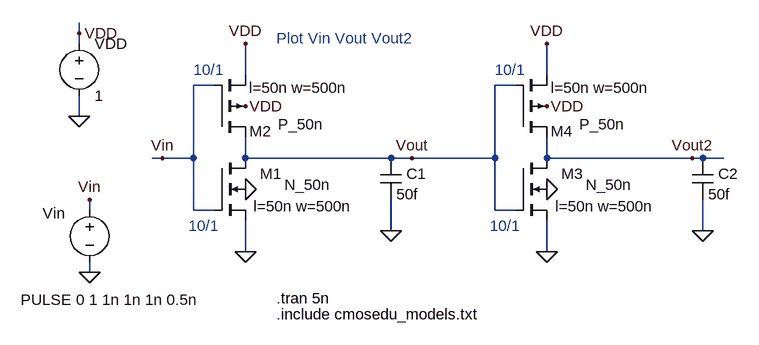
[diagram p0: schematic Fig18_14.asc]
Fig18_14.asc, the LTspice schematic file:
Version 4
SHEET 1 1256 680
WIRE 192 -368 192 -384
WIRE 192 -352 192 -368
WIRE 448 -304 448 -352
WIRE 912 -304 912 -352
WIRE 400 -288 368 -288
WIRE 864 -288 832 -288
WIRE 192 -240 192 -272
WIRE 320 -176 304 -176
WIRE 368 -176 368 -288
WIRE 368 -176 320 -176
WIRE 448 -176 448 -208
WIRE 672 -176 448 -176
WIRE 704 -176 672 -176
WIRE 832 -176 832 -288
WIRE 832 -176 704 -176
WIRE 912 -176 912 -208
WIRE 1136 -176 912 -176
WIRE 1152 -176 1136 -176
WIRE 1184 -176 1152 -176
WIRE 208 -96 208 -112
WIRE 368 -96 368 -176
WIRE 400 -96 368 -96
WIRE 832 -96 832 -176
WIRE 864 -96 832 -96
WIRE 672 -64 672 -112
WIRE 1152 -64 1152 -112
WIRE 448 -32 448 -80
WIRE 912 -32 912 -80
WIRE 208 0 208 -16
FLAG 208 0 0
FLAG 704 -176 Vout
FLAG 208 -112 Vin
FLAG 448 -128 0
FLAG 192 -240 0
FLAG 192 -368 VDD
FLAG 448 -256 VDD
FLAG 448 -32 0
FLAG 448 -352 VDD
FLAG 320 -176 Vin
FLAG 672 -64 0
FLAG 912 -128 0
FLAG 912 -256 VDD
FLAG 912 -32 0
FLAG 912 -352 VDD
FLAG 1136 -176 Vout2
FLAG 1152 -64 0
SYMBOL nmos4 400 -176 R0
WINDOW 0 104 24 Right 2
WINDOW 3 179 41 Right 2
WINDOW 123 213 74 Right 2
SYMATTR InstName M1
SYMATTR Value N_50n
SYMATTR Value2 l=50n w=500n
SYMBOL voltage 208 -112 R0
WINDOW 0 -72 21 Left 2
WINDOW 3 -106 154 Left 2
WINDOW 123 0 0 Left 2
WINDOW 39 0 0 Left 2
SYMATTR InstName Vin
SYMATTR Value PULSE 0 1 1n 1n 1n 0.5n
SYMBOL voltage 192 -368 R0
WINDOW 123 0 0 Left 2
WINDOW 39 0 0 Left 2
SYMATTR InstName VDD
SYMATTR Value 1
SYMBOL pmos4 400 -208 M180
WINDOW 0 88 9 Right 2
WINDOW 3 168 20 Right 2
WINDOW 123 206 76 Right 2
SYMATTR InstName M2
SYMATTR Value P_50n
SYMATTR Value2 l=50n w=500n
SYMBOL cap 656 -176 R0
WINDOW 0 40 24 Left 2
SYMATTR InstName C1
SYMATTR Value 50f
SYMBOL nmos4 864 -176 R0
WINDOW 0 104 24 Right 2
WINDOW 3 179 41 Right 2
WINDOW 123 213 74 Right 2
SYMATTR InstName M3
SYMATTR Value N_50n
SYMATTR Value2 l=50n w=500n
SYMBOL pmos4 864 -208 M180
WINDOW 0 88 9 Right 2
WINDOW 3 168 20 Right 2
WINDOW 123 206 76 Right 2
SYMATTR InstName M4
SYMATTR Value P_50n
SYMATTR Value2 l=50n w=500n
SYMBOL cap 1136 -176 R0
WINDOW 0 40 24 Left 2
SYMATTR InstName C2
SYMATTR Value 50f
TEXT 496 40 Left 2 !.tran 5n
TEXT 496 64 Left 2 !.include cmosedu_models.txt
TEXT 496 -360 Left 2 ;Plot Vin Vout Vout2
TEXT 368 -312 Left 2 ;10/1
TEXT 360 -72 Left 2 ;10/1
TEXT 832 -312 Left 2 ;10/1
TEXT 824 -72 Left 2 ;10/1

The netlist it stands for:
* Fig18_14.asc
M1 Vout Vin 0 0 N_50n l=50n w=500n
Vin Vin 0 PULSE 0 1 1n 1n 1n 0.5n
VDD VDD 0 1
M2 Vout Vin VDD VDD P_50n l=50n w=500n
C1 Vout 0 50f
M3 Vout2 Vout 0 0 N_50n l=50n w=500n
M4 Vout2 Vout VDD VDD P_50n l=50n w=500n
C2 Vout2 0 50f
.model NMOS NMOS
.model PMOS PMOS
.lib standard.mos
.tran 5n
.include cmosedu_models.txt
* Plot Vin Vout Vout2
* 10/1
* 10/1
* 10/1
* 10/1
.backanno
.end